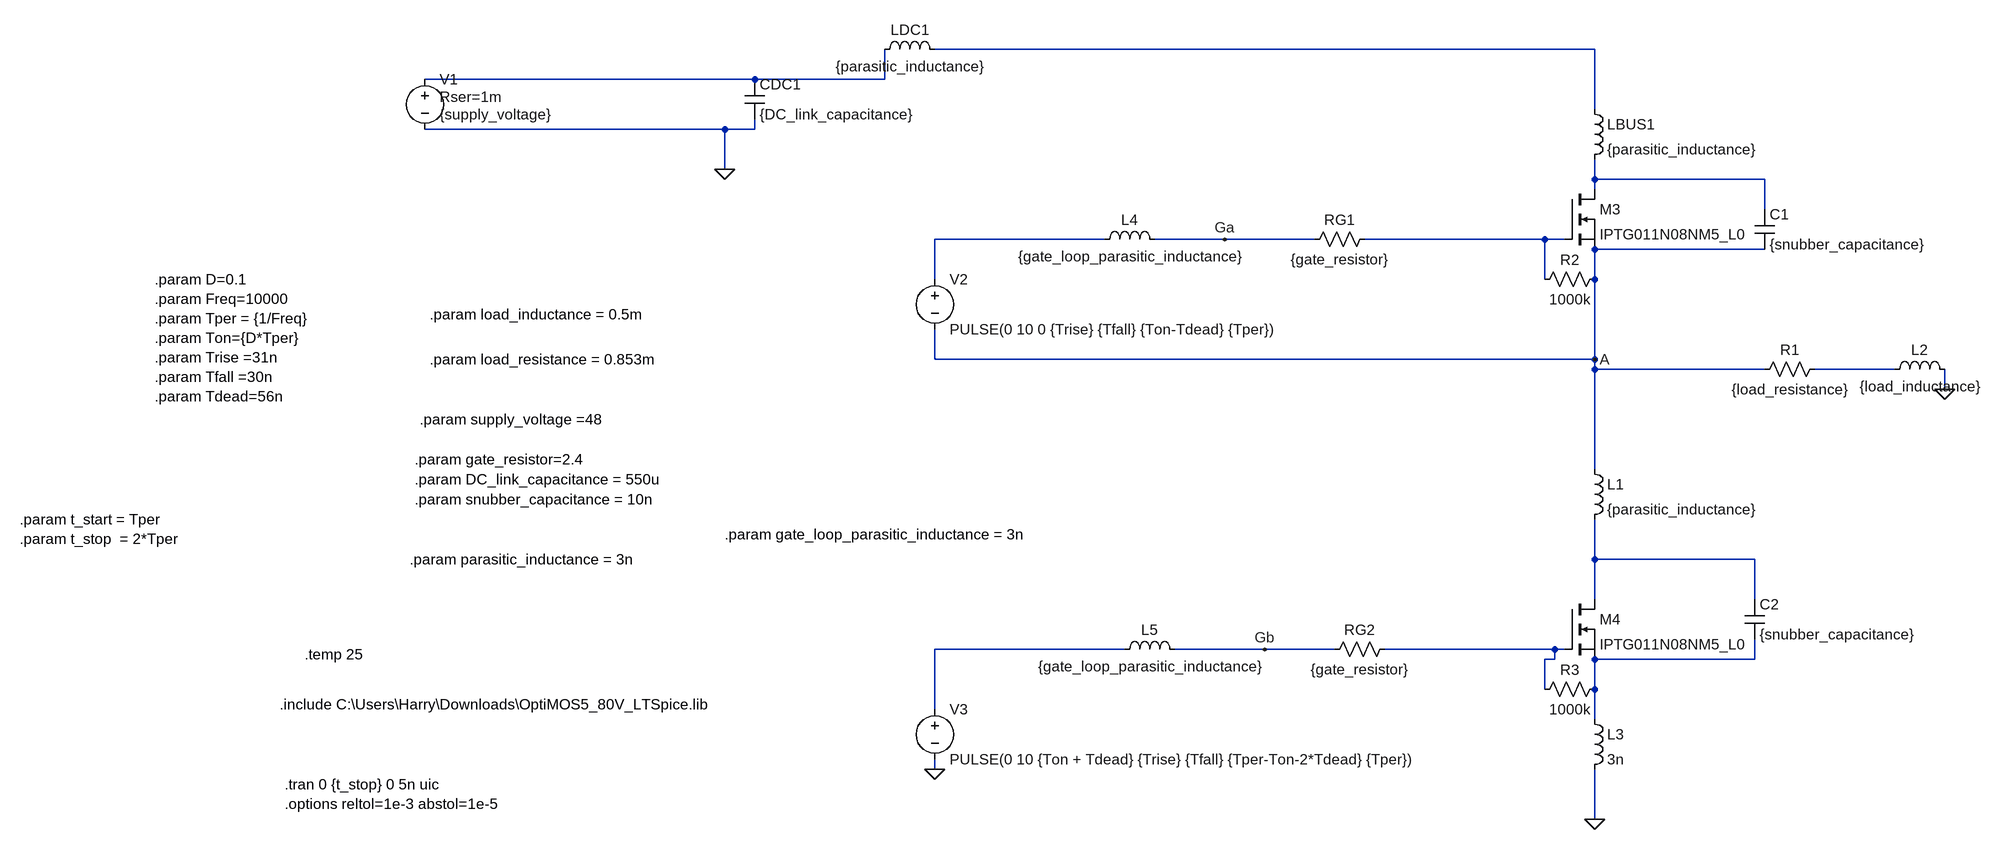
[diagram p0: schematic LTspice_checking.asc]
LTspice_checking.asc, the LTspice schematic file:
Version 4.1
SHEET 1 7924 1440
WIRE 1136 -560 80 -560
WIRE -208 -512 -736 -512
WIRE 0 -512 0 -560
WIRE 0 -512 -208 -512
WIRE 1136 -464 1136 -560
WIRE -256 -432 -736 -432
WIRE -208 -432 -208 -448
WIRE -208 -432 -256 -432
WIRE -256 -368 -256 -432
WIRE 1136 -352 1136 -384
WIRE 1408 -352 1136 -352
WIRE 1136 -336 1136 -352
WIRE 1408 -304 1408 -352
WIRE 352 -256 80 -256
WIRE 544 -256 432 -256
WIRE 688 -256 544 -256
WIRE 1056 -256 768 -256
WIRE 1088 -256 1056 -256
WIRE 1408 -240 1136 -240
WIRE 80 -192 80 -256
WIRE 1056 -192 1056 -256
WIRE 1136 -192 1136 -240
WIRE 80 -64 80 -112
WIRE 1136 -64 1136 -192
WIRE 1136 -64 80 -64
WIRE 1136 -48 1136 -64
WIRE 1408 -48 1136 -48
WIRE 1616 -48 1488 -48
WIRE 1696 -16 1696 -48
WIRE 1136 112 1136 -48
WIRE 1136 256 1136 192
WIRE 1392 256 1136 256
WIRE 1136 320 1136 256
WIRE 1392 320 1392 256
WIRE 384 400 80 400
WIRE 608 400 464 400
WIRE 720 400 608 400
WIRE 1072 400 800 400
WIRE 1088 400 1072 400
WIRE 1072 416 1072 400
WIRE 1072 416 1056 416
WIRE 1136 416 1136 400
WIRE 1392 416 1392 384
WIRE 1392 416 1136 416
WIRE 1056 464 1056 416
WIRE 1136 464 1136 416
WIRE 80 496 80 400
WIRE 1136 512 1136 464
WIRE 80 592 80 576
WIRE 1136 672 1136 592
FLAG 544 -256 Ga
FLAG 608 400 Gb
FLAG 1696 -16 0
FLAG 1136 -64 A
FLAG -256 -368 0
FLAG 1136 672 0
FLAG 80 592 0
SYMBOL voltage -736 -528 R0
WINDOW 123 0 0 Left 0
WINDOW 39 24 44 Left 2
WINDOW 3 24 72 Left 2
SYMATTR SpiceLine Rser=1m
SYMATTR Value {supply_voltage}
SYMATTR InstName V1
SYMBOL cap -224 -512 R0
SYMATTR InstName CDC1
SYMATTR Value {DC_link_capacitance}
SYMATTR SpiceLine Rser=1m
SYMBOL ind -16 -544 R270
WINDOW 0 32 56 VTop 2
WINDOW 3 5 56 VBottom 2
SYMATTR InstName LDC1
SYMATTR Value {parasitic_inductance}
SYMATTR SpiceLine Rser=1m
SYMBOL res 1504 -64 R90
WINDOW 0 0 56 VBottom 2
WINDOW 3 32 56 VTop 2
SYMATTR InstName R1
SYMATTR Value {load_resistance}
SYMBOL res 784 -272 R90
WINDOW 0 0 56 VBottom 2
WINDOW 3 32 56 VTop 2
SYMATTR InstName RG1
SYMATTR Value {gate_resistor}
SYMBOL res 816 384 R90
WINDOW 0 0 56 VBottom 2
WINDOW 3 32 56 VTop 2
SYMATTR InstName RG2
SYMATTR Value {gate_resistor}
SYMBOL ind 1120 -480 R0
SYMATTR InstName LBUS1
SYMATTR Value {parasitic_inductance}
SYMATTR SpiceLine Rser=1m
SYMBOL ind 1120 96 R0
SYMATTR InstName L1
SYMATTR Value {parasitic_inductance}
SYMATTR SpiceLine Rser=1m
SYMBOL ind 1600 -32 R270
WINDOW 0 32 56 VTop 2
WINDOW 3 5 56 VBottom 2
SYMATTR InstName L2
SYMATTR Value {load_inductance}
SYMATTR SpiceLine Rser=1m
SYMBOL ind 1120 496 R0
SYMATTR InstName L3
SYMATTR Value 3n
SYMATTR SpiceLine Rser=1m
SYMBOL voltage 80 -208 R0
WINDOW 123 0 0 Left 0
WINDOW 39 0 0 Left 0
SYMATTR InstName V2
SYMATTR Value PULSE(0 10 0 {Trise} {Tfall} {Ton-Tdead} {Tper})
SYMBOL voltage 80 480 R0
WINDOW 123 0 0 Left 0
WINDOW 39 0 0 Left 0
SYMATTR InstName V3
SYMATTR Value PULSE(0 10 {Ton + Tdead} {Trise} {Tfall} {Tper-Ton-2*Tdead} {Tper})
SYMBOL ind 336 -240 R270
WINDOW 0 32 56 VTop 2
WINDOW 3 5 56 VBottom 2
SYMATTR InstName L4
SYMATTR Value {gate_loop_parasitic_inductance}
SYMATTR SpiceLine Rser=1m
SYMBOL ind 368 416 R270
WINDOW 0 32 56 VTop 2
WINDOW 3 5 56 VBottom 2
SYMATTR InstName L5
SYMATTR Value {gate_loop_parasitic_inductance}
SYMATTR SpiceLine Rser=1m
SYMBOL res 1152 -208 R90
WINDOW 0 0 56 VBottom 2
WINDOW 3 32 56 VTop 2
SYMATTR InstName R2
SYMATTR Value 1000k
SYMBOL res 1152 448 R90
WINDOW 0 0 56 VBottom 2
WINDOW 3 32 56 VTop 2
SYMATTR InstName R3
SYMATTR Value 1000k
SYMBOL cap 1392 -304 R0
SYMATTR InstName C1
SYMATTR Value {snubber_capacitance}
SYMBOL cap 1376 320 R0
SYMATTR InstName C2
SYMATTR Value {snubber_capacitance}
SYMBOL nmos 1088 -336 R0
SYMATTR InstName M3
SYMATTR Value IPTG011N08NM5_L0
SYMATTR Prefix X
SYMBOL nmos 1088 320 R0
SYMATTR InstName M4
SYMATTR Value IPTG011N08NM5_L0
SYMATTR Prefix X
TEXT -1168 -192 Left 2 !.param D=0.1\n.param Freq=10000\n.param Tper = {1/Freq}\n.param Ton={D*Tper}\n.param Trise =31n\n.param Tfall =30n\n.param Tdead=56n
TEXT -960 616 Left 2 !.tran 0 {t_stop} 0 5n uic\n.options reltol=1e-3 abstol=1e-5
TEXT -968 488 Left 2 !.include C:\\Users\\Harry\\Downloads\\OptiMOS5_80V_LTSpice.lib
TEXT -928 408 Left 2 !.temp 25
TEXT -752 160 Left 2 !.param snubber_capacitance = 10n
TEXT -752 128 Left 2 !.param DC_link_capacitance = 550u
TEXT -752 96 Left 2 !.param gate_resistor=2.4
TEXT -744 32 Left 2 !.param supply_voltage =48
TEXT -728 -64 Left 2 !.param load_resistance = 0.853m
TEXT -728 -136 Left 2 !.param load_inductance = 0.5m
TEXT -760 256 Left 2 !.param parasitic_inductance = 3n
TEXT -256 216 Left 2 !.param gate_loop_parasitic_inductance = 3n
TEXT -1384 192 Left 2 !.param t_start = Tper\n.param t_stop  = 2*Tper

The netlist it stands for:
* LTspice_checking.asc
V1 N002 0 {supply_voltage} Rser=1m
CDC1 N002 0 {DC_link_capacitance} Rser=1m
LDC1 N002 N001 {parasitic_inductance} Rser=1m
R1 N006 A {load_resistance}
RG1 N005 Ga {gate_resistor}
RG2 N009 Gb {gate_resistor}
LBUS1 N001 N003 {parasitic_inductance} Rser=1m
L1 A N007 {parasitic_inductance} Rser=1m
L2 N006 0 {load_inductance} Rser=1m
L3 N010 0 3n Rser=1m
V2 N004 A PULSE(0 10 0 {Trise} {Tfall} {Ton-Tdead} {Tper})
V3 N008 0 PULSE(0 10 {Ton + Tdead} {Trise} {Tfall} {Tper-Ton-2*Tdead} {Tper})
L4 N004 Ga {gate_loop_parasitic_inductance} Rser=1m
L5 N008 Gb {gate_loop_parasitic_inductance} Rser=1m
R2 A N005 1000k
R3 N010 N009 1000k
C1 N003 A {snubber_capacitance}
C2 N007 N010 {snubber_capacitance}
X§M3 N003 N005 A IPTG011N08NM5_L0  ; pins D G S
X§M4 N007 N009 N010 IPTG011N08NM5_L0  ; pins D G S
.param D=0.1
.param Freq=10000
.param Tper = {1/Freq}
.param Ton={D*Tper}
.param Trise =31n
.param Tfall =30n
.param Tdead=56n
.tran 0 {t_stop} 0 5n uic
.options reltol=1e-3 abstol=1e-5
.include C:\Users\Harry\Downloads\OptiMOS5_80V_LTSpice.lib
.temp 25
.param snubber_capacitance = 10n
.param DC_link_capacitance = 550u
.param gate_resistor=2.4
.param supply_voltage =48
.param load_resistance = 0.853m
.param load_inductance = 0.5m
.param parasitic_inductance = 3n
.param gate_loop_parasitic_inductance = 3n
.param t_start = Tper
.param t_stop  = 2*Tper
.backanno
.end